# Altium schematic sheet Connectors.SchDoc
size A; SheetNumber: 5; SheetTotal: 5
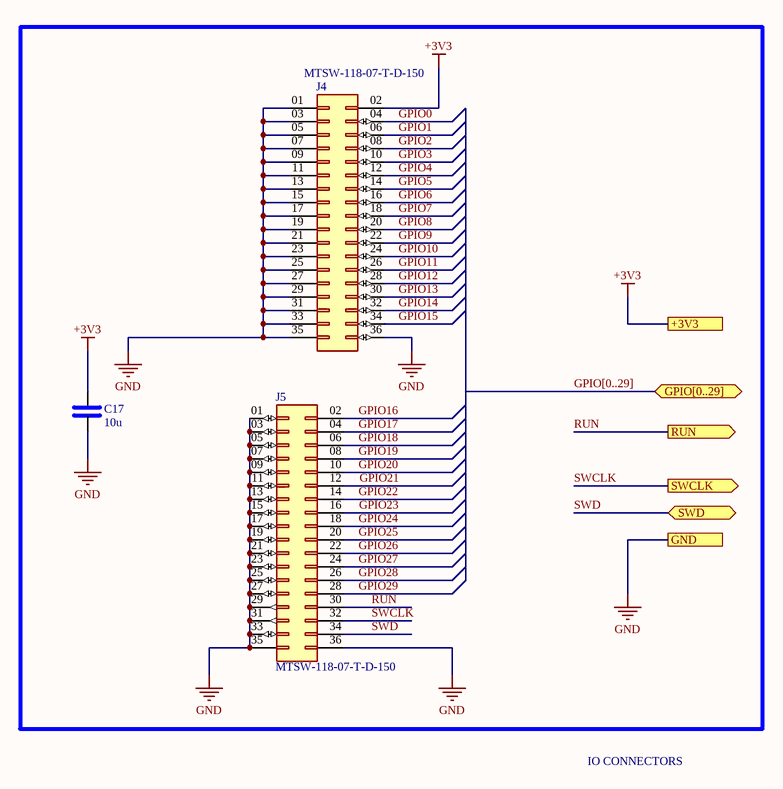
[diagram p0: Connectors.SchDoc]

## Parts
C17  10u  [VJ0805]
J4  MTSW-118-07-T-D-150  [SAMTEC_MTSW-118-07-T-D-150]
J5  MTSW-118-07-T-D-150  [SAMTEC_MTSW-118-07-T-D-150]

## Ports
+3V3 (see Master[4B], Flash[4B], MCU[1A], Supply[4B]), GND (see Master[4B], Flash[4C], MCU[1B], Supply[4C]), GPIO[0..29] (bidir, see Master[3B], MCU[4C]), RUN (out, see Master[3B], MCU[4D]), SWCLK (out, see Master[3B], MCU[4D]), SWD (bidir, see Master[3B], MCU[4D])

## Nets
+3V3: C17.2 J4.02 ; port +3V3
GND: C17.1 J4.01 J4.03 J4.05 J4.07 J4.09 J4.11 J4.13 J4.15 J4.17 J4.19 J4.21 J4.23 J4.25 J4.27 J4.29 J4.31 J4.33 J4.35 J4.36 J5.01 J5.03 J5.05 J5.07 J5.09 J5.11 J5.13 J5.15 J5.17 J5.19 J5.21 J5.23 J5.25 J5.27 J5.29 J5.31 J5.33 J5.35 J5.36 ; port GND
GPIO0: J4.04
GPIO1: J4.06
GPIO2: J4.08
GPIO3: J4.10
GPIO4: J4.12
GPIO5: J4.14
GPIO6: J4.16
GPIO7: J4.18
GPIO8: J4.20
GPIO9: J4.22
GPIO10: J4.24
GPIO11: J4.26
GPIO12: J4.28
GPIO13: J4.30
GPIO14: J4.32
GPIO15: J4.34
GPIO16: J5.02
GPIO17: J5.04
GPIO18: J5.06
GPIO19: J5.08
GPIO20: J5.10
GPIO21: J5.12
GPIO22: J5.14
GPIO23: J5.16
GPIO24: J5.18
GPIO25: J5.20
GPIO26: J5.22
GPIO27: J5.24
GPIO28: J5.26
GPIO29: J5.28
RUN: J5.30 ; port RUN
SWCLK: J5.32 ; port SWCLK
SWD: J5.34 ; port SWD

## Buses and harness runs
bus GPIO[0..29] = port GPIO[0..29]

## Notes on the sheet
- IO CONNECTORS

## Library data of the parts
C17 = 0805 SMD Capacitor: Ceramic Capacitor, Multilayer, Ceramic, 25V, 10% +Tol, 10% -Tol, X5R, 15% TC, 10uF, Surface Mount, 0805; Manufacturer: Murata; Manufacturer Part Number: GRM21BR61E106KA73K; Multilayer: Yes; ComponentLink1Description: Link; ComponentLink1URL: *; Supplier: Future Electronics; Supplier Part Number: 9092991; RoHS: Yes; Category: Ceramic Capacitors; Stock: 40000; Pricing: 10000=0.0248, 20000=0.0245, 30000=0.0242, 40000=0.0241, 50000=0.0236 (USD); Mounting Technology: Surface Mount; Pins: 2; Dielectric Material: Ceramic; Package Shape: Rectangular; Case/Package: 0805; Terminal Finish: Nickel; Min Operating Temperature: -55°C; Max Operating Temperature: 85°C; JESD-609 Code: e3; Value: 10uF; Capacitor Type: Ceramic; Tolerance  (fill in as +-): 10%; Package Style: SMTMeter; Packaging: Tape and Reel; Tolerance (fill in as +-): 10%; Rated DC Voltage (URdc): 25V; Temperature Characteristics Code: X5R; Termination: Wraparound; Length: 2mm; Width: 1.25mm; Height: 1.25mm; Reach SVHC Compliant: Yes; RoHS Compliant: Yes; ComponentLink2URL: https://datasheet.ciiva.com:443/pdfs/VipMasterIC/IC/MURE/MURE-S-A0004349797/MURE-S-A0004361627-1.pdf?src-supplier=IHS+Markit; ComponentLink2Description: https://datasheet.ciiva.com:443/pdfs/VipMasterIC/IC/MURE/MURE-S-A0004349797/MURE-S-A0004361627-1.pdf?src-supplier=IHS+Markit; ComponentLink3URL: http://www.mouser.com/ds/2/281/c02e-2905.pdf?src-supplier=Mouser; ComponentLink3Description: http://www.mouser.com/ds/2/281/c02e-2905.pdf?src-supplier=Mouser; ComponentLink4URL: https://datasheet.octopart.com/GRM21BR61E106KA73K-Murata-datasheet-149523495.pdf?src-supplier=Newark; ComponentLink4Description: https://datasheet.octopart.com/GRM21BR61E106KA73K-Murata-datasheet-149523495.pdf?src-supplier=Newark; ComponentLink5URL: https://datasheet.octopart.com/GRM21BR61E106KA73K-Murata-datasheet-99353849.pdf?src-supplier=Future+Electronics; ComponentLink5Description: https://datasheet.octopart.com/GRM21BR61E106KA73K-Murata-datasheet-99353849.pdf?src-supplier=Future+Electronics; ComponentLink6URL: http://search.murata.co.jp/Ceramy/image/img/A01X/G101/ENG/GRM21BR61E106KA73-01.pdf?src-supplier=Digikey; ComponentLink6Description: http://search.murata.co.jp/Ceramy/image/img/A01X/G101/ENG/GRM21BR61E106KA73-01.pdf?src-supplier=Digikey; ComponentLink7URL: https://search.murata.co.jp/Ceramy/image/img/A01X/G101/ENG/GRM21BR61E106KA73-01.pdf?src-supplier=Digikey; ComponentLink7Description: https://search.murata.co.jp/Ceramy/image/img/A01X/G101/ENG/GRM21BR61E106KA73-01.pdf?src-supplier=Digikey; ComponentLink8URL: https://datasheet.octopart.com/GRM21BR61E106KA73K-Murata-datasheet-165579666.pdf?src-supplier=TME; ComponentLink8Description: https://datasheet.octopart.com/GRM21BR61E106KA73K-Murata-datasheet-165579666.pdf?src-supplier=TME
J4 J5 = MTSW-118-07-T-D-150: Package: None; Price: None; Value: *; MP: MTSW-118-07-T-D-150; Availability: Unavailable